# Altium project PCB_Project.PrjPcb
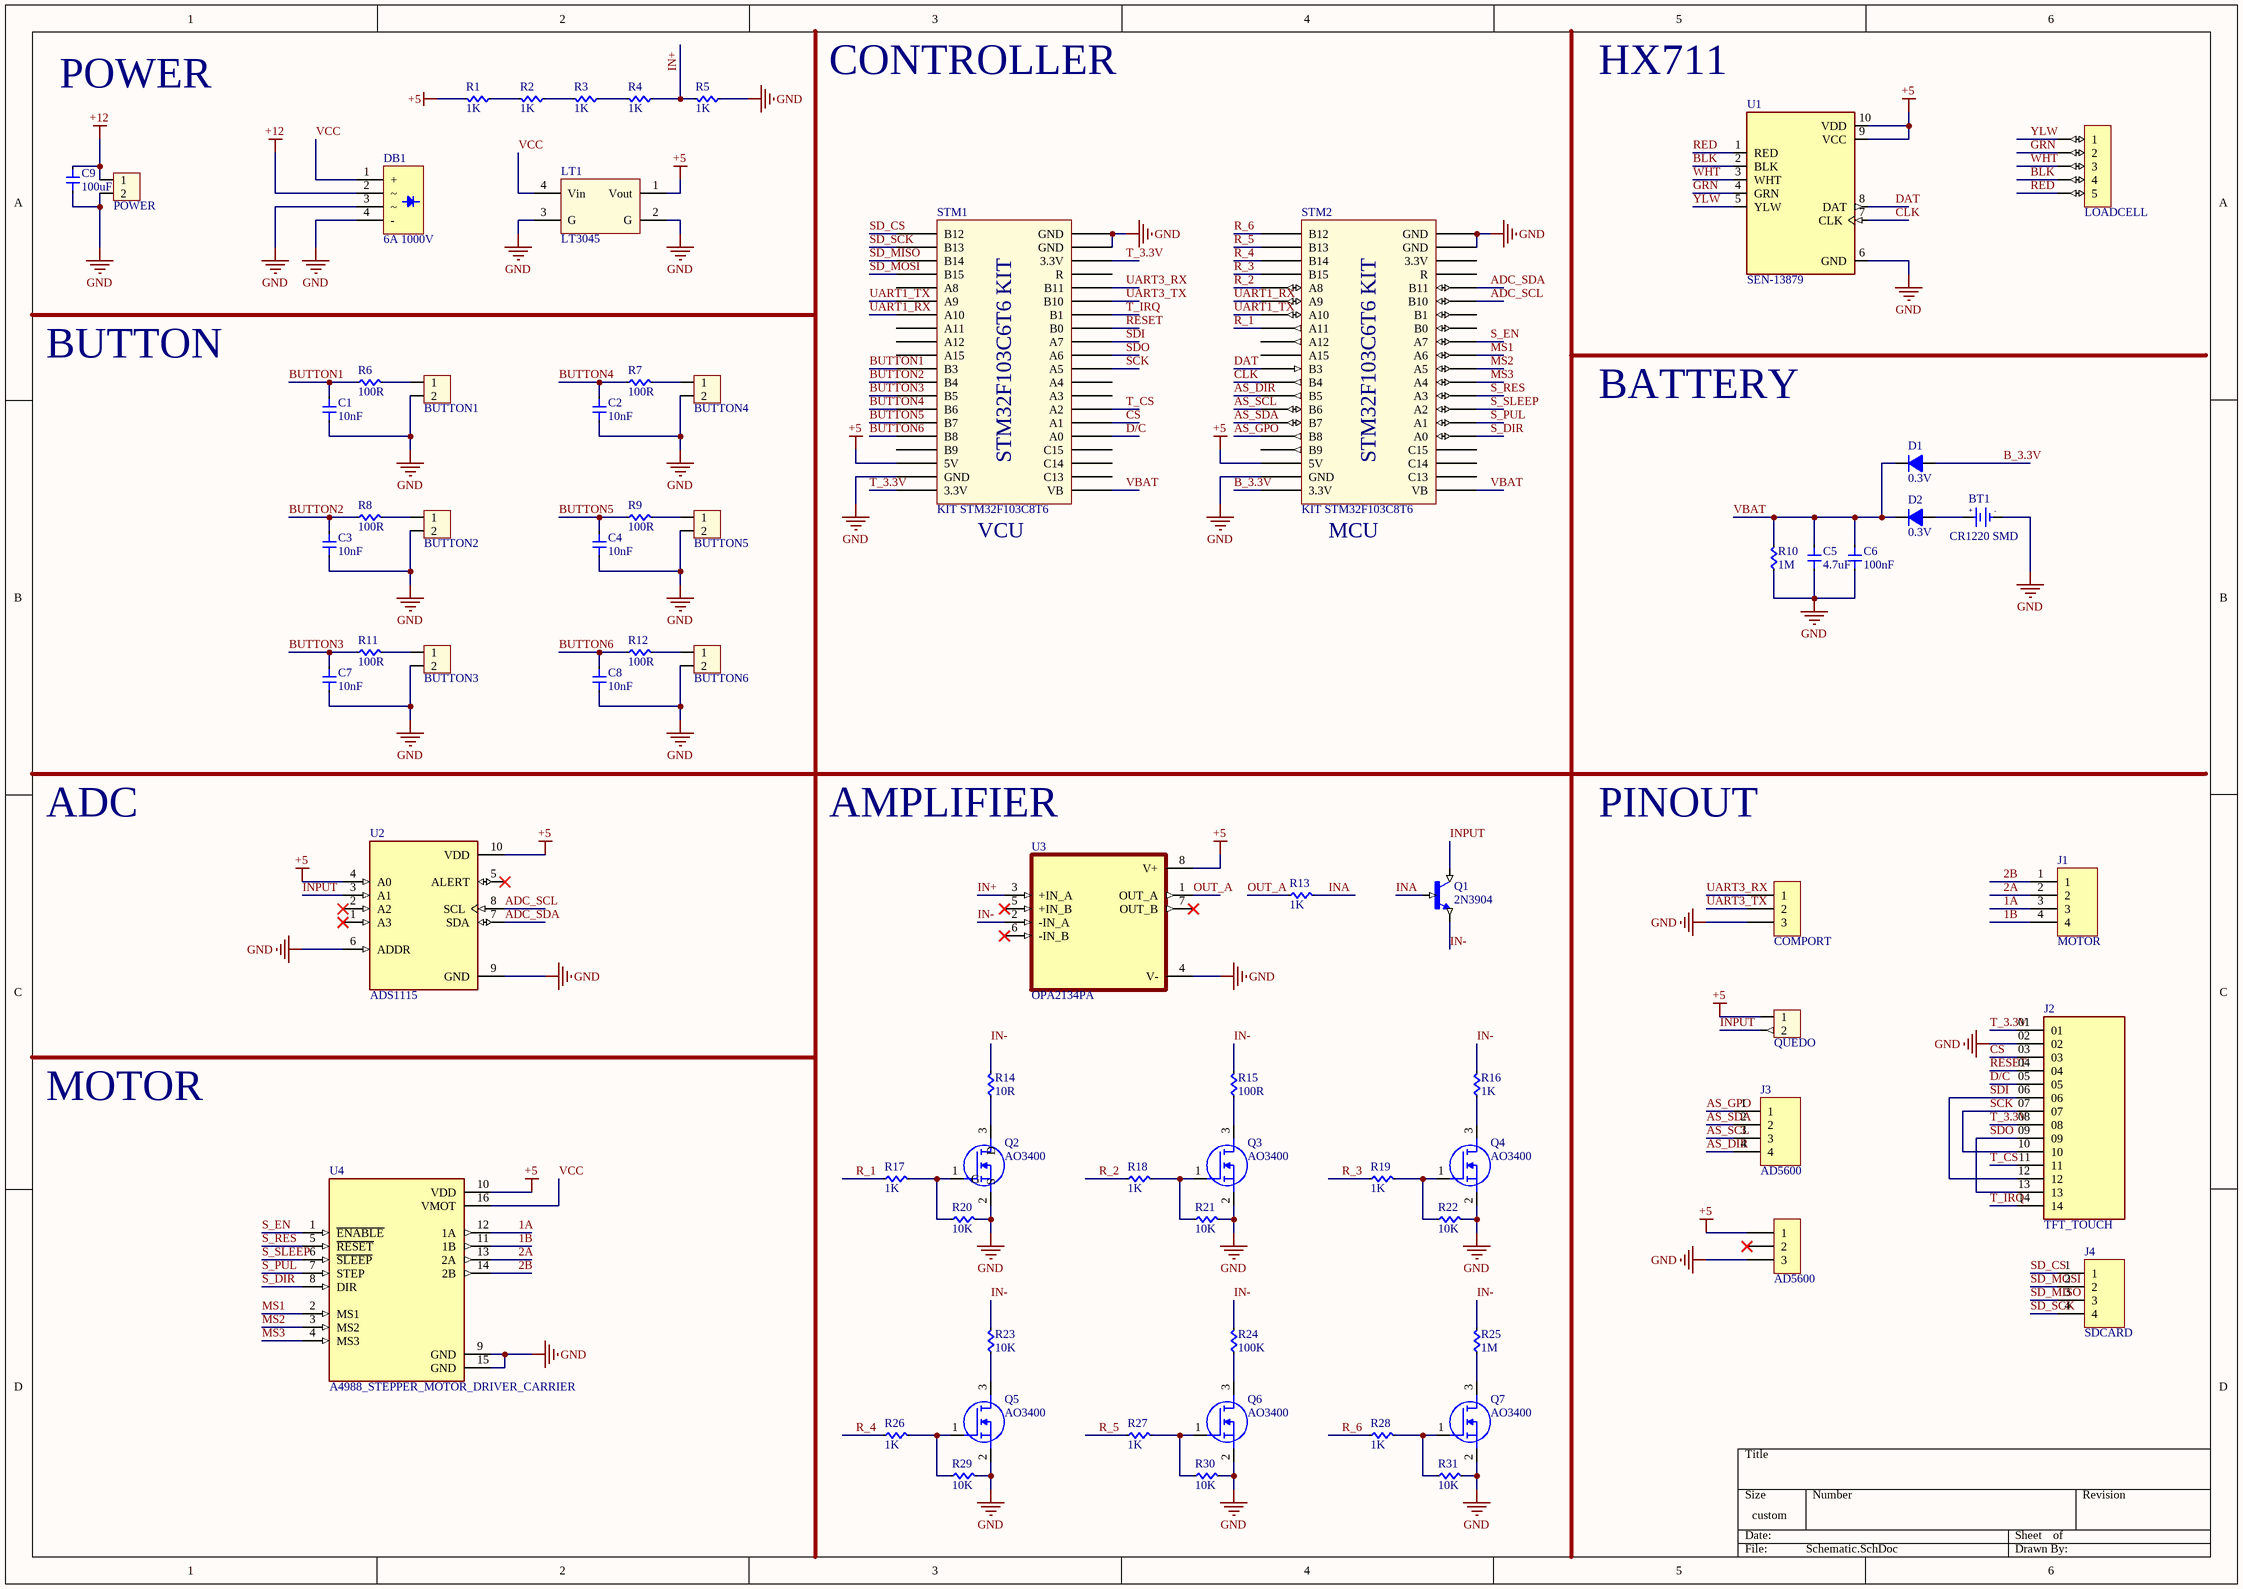
[diagram p0: Schematic.SchDoc]
1 sheet, 73 parts. Net scope: global (net labels, ports and power ports of the same name join across sheets).
Board file: PCB1.PcbDoc

## Sheet Schematic.SchDoc
size 420 x 297 mm; SheetNumber: 1; SheetTotal: 1

### Parts
BT1  CR1220 SMD  [DE PIN CR1220]
C1  10nF  [Cap 1206]
C2  10nF  [Cap 1206]
C3  10nF  [Cap 1206]
C4  10nF  [Cap 1206]
C5  4.7uF  [Cap 1206]
C6  100nF  [Cap 1206]
C7  10nF  [Cap 1206]
C8  10nF  [Cap 1206]
C9  100uF  [Cap 1206]
D1  0.3V  [DIODE 1A]
D2  0.3V  [DIODE 1A]
DB1  6A 1000V  [DIODE CAU 6A CAM]
H1  LOADCELL  [XH2.54M-5]
H2  POWER  [XH2.54M-2]
H3  BUTTON1  [XH2.54M-2]
H4  BUTTON4  [XH2.54M-2]
H5  BUTTON2  [XH2.54M-2]
H6  BUTTON5  [XH2.54M-2]
H7  BUTTON3  [XH2.54M-2]
H8  BUTTON6  [XH2.54M-2]
H9  COMPORT  [XH2.54M-3]
H10  QUEDO  [XH2.54M-2]
H11  AD5600  [XH2.54M-3]
J1  MOTOR  [CON4_78_B4B-PH-K-S(LF)(SN)]
J2  TFT_TOUCH  [SAMTEC_ESQ-114-38-G-S]
J3  AD5600  [CON4_78_B4B-PH-K-S(LF)(SN)]
J4  SDCARD  [CON4_78_B4B-PH-K-S(LF)(SN)]
LT1  LT3045  [PCBComponent_1]
Q1  2N3904  [TO92254P460H750-3]
Q2  AO3400  [SOT95P280X125-3N]
Q3  AO3400  [SOT95P280X125-3N]
Q4  AO3400  [SOT95P280X125-3N]
Q5  AO3400  [SOT95P280X125-3N]
Q6  AO3400  [SOT95P280X125-3N]
Q7  AO3400  [SOT95P280X125-3N]
R1  1K  [RES 1206]
R2  1K  [RES 1206]
R3  1K  [RES 1206]
R4  1K  [RES 1206]
R5  1K  [RES 1206]
R6  100R  [RES 1206]
R7  100R  [RES 1206]
R8  100R  [RES 1206]
R9  100R  [RES 1206]
R10  1M  [RES 1206]
R11  100R  [RES 1206]
R12  100R  [RES 1206]
R13  1K  [RES 1206]
R14  10R  [RES 1206]
R15  100R  [RES 1206]
R16  1K  [RES 1206]
R17  1K  [RES 1206]
R18  1K  [RES 1206]
R19  1K  [RES 1206]
R20  10K  [RES 1206]
R21  10K  [RES 1206]
R22  10K  [RES 1206]
R23  10K  [RES 1206]
R24  100K  [RES 1206]
R25  1M  [RES 1206]
R26  1K  [RES 1206]
R27  1K  [RES 1206]
R28  1K  [RES 1206]
R29  10K  [RES 1206]
R30  10K  [RES 1206]
R31  10K  [RES 1206]
STM1  KIT STM32F103C8T6  [STM32F103 KIT]
STM2  KIT STM32F103C8T6  [STM32F103 KIT]
U1  SEN-13879  [SPARKFUN_SEN-13879]
U2  ADS1115  [MODULE_ZC261500]
U3  OPA2134PA  [DIP794W45P254L959H508Q8]
U4  A4988_STEPPER_MOTOR_DRIVER_CARRIER  [MODULE_A4988_STEPPER_MOTOR_DRIVER_CARRIER]

### Nets
+5: H10.1 H11.1 LT1.1(Vout) R1.2 STM1.18(5V) STM2.18(5V) U1.9(VCC) U1.10(VDD) U2.4(A0) U2.10(VDD) U3.8(V+) U4.10(VDD)
+12: C9.1 DB1.2 H2.1
GND: BT1.2(GND) C1.2 C2.2 C3.2 C4.2 C5.2 C6.2 C7.2 C8.2 C9.2 DB1.3 DB1.4(-) H2.2 H3.2 H4.2 H5.2 H6.2 H7.2 H8.2 H9.3 H11.3 J2.02 LT1.2(G) LT1.3(G) Q2.2(S) Q3.2(S) Q4.2(S) Q5.2(S) Q6.2(S) Q7.2(S) R5.1 R10.1 R20.2 R21.2 R22.2 R29.2 R30.2 R31.2 STM1.19(GND) STM1.39(GND) STM1.40(GND) STM2.19(GND) STM2.39(GND) STM2.40(GND) U1.6(GND) U2.6(ADDR) U2.9(GND) U3.4(V-) U4.9(GND) U4.15(GND)
1A: J1.3 U4.12(1A)
1B: J1.4 U4.11(1B)
2A: J1.2 U4.13(2A)
2B: J1.1 U4.14(2B)
ADC_SCL: STM2.35(B10) U2.8(SCL)
ADC_SDA: STM2.36(B11) U2.7(SDA)
AS_DIR: J3.4 STM2.13(B5)
AS_GPO: J3.1 STM2.16(B8)
AS_SCL: J3.3 STM2.14(B6)
AS_SDA: J3.2 STM2.15(B7)
B_3.3V: D1.1(A) STM2.20(3.3V)
BLK: H1.4 U1.2(BLK)
BUTTON1: C1.1 R6.1 STM1.11(B3)
BUTTON2: C3.1 R8.1 STM1.12(B4)
BUTTON3: C7.1 R11.1 STM1.13(B5)
BUTTON4: C2.1 R7.1 STM1.14(B6)
BUTTON5: C4.1 R9.1 STM1.15(B7)
BUTTON6: C8.1 R12.1 STM1.16(B8)
CLK: STM2.12(B4) U1.7(CLK)
CS: J2.03 STM1.26(A1)
D/C: J2.05 STM1.25(A0)
DAT: STM2.11(B3) U1.8(DAT)
GRN: H1.2 U1.4(GRN)
IN+: R4.1 R5.2 U3.3(+IN_A)
IN-: Q1.1(E) R14.2 R15.2 R16.2 R23.2 R24.2 R25.2 U3.2(-IN_A)
INA: Q1.2(B) R13.2
INPUT: H10.2 Q1.3(C) U2.3(A1)
MS1: STM2.31(A6) U4.2(MS1)
MS2: STM2.30(A5) U4.3(MS2)
MS3: STM2.29(A4) U4.4(MS3)
OUT_A: R13.1 U3.1(OUT_A)
R_1: R17.1 STM2.8(A11)
R_2: R18.1 STM2.5(A8)
R_3: R19.1 STM2.4(B15)
R_4: R26.1 STM2.3(B14)
R_5: R27.1 STM2.2(B13)
R_6: R28.1 STM2.1(B12)
RED: H1.5 U1.1(RED)
RESET: J2.04 STM1.33(B0)
S_DIR: STM2.25(A0) U4.8(DIR)
S_EN: STM2.32(A7) U4.1(~{ENABLE})
S_PUL: STM2.26(A1) U4.7(STEP)
S_RES: STM2.28(A3) U4.5(~{RESET})
S_SLEEP: STM2.27(A2) U4.6(~{SLEEP})
SCK: J2.07 J2.10 STM1.30(A5)
SD_CS: J4.1 STM1.1(B12)
SD_MISO: J4.3 STM1.3(B14)
SD_MOSI: J4.2 STM1.4(B15)
SD_SCK: J4.4 STM1.2(B13)
SDI: J2.06 J2.12 STM1.32(A7)
SDO: J2.09 J2.13 STM1.31(A6)
T_3.3V: J2.01 J2.08 STM1.20(3.3V) STM1.38(3.3V)
T_CS: J2.11 STM1.27(A2)
T_IRQ: J2.14 STM1.34(B1)
UART1_RX: STM1.7(A10) STM2.6(A9)
UART1_TX: STM1.6(A9) STM2.7(A10)
UART3_RX: H9.1 STM1.36(B11)
UART3_TX: H9.2 STM1.35(B10)
VBAT: C5.1 C6.1 D1.2(K) D2.2(K) R10.2 STM1.21(VB) STM2.21(VB)
VCC: DB1.1(+) LT1.4(Vin) U4.16(VMOT)
WHT: H1.3 U1.3(WHT)
YLW: H1.1 U1.5(YLW)
NetBT1_1: BT1.1(+3V) D2.1(A)
NetH3_1: H3.1 R6.2
NetH4_1: H4.1 R7.2
NetH5_1: H5.1 R8.2
NetH6_1: H6.1 R9.2
NetH7_1: H7.1 R11.2
NetH8_1: H8.1 R12.2
NetQ2_1: Q2.1(G) R17.2 R20.1
NetQ2_3: Q2.3(D) R14.1
NetQ3_1: Q3.1(G) R18.2 R21.1
NetQ3_3: Q3.3(D) R15.1
NetQ4_1: Q4.1(G) R19.2 R22.1
NetQ4_3: Q4.3(D) R16.1
NetQ5_1: Q5.1(G) R26.2 R29.1
NetQ5_3: Q5.3(D) R23.1
NetQ6_1: Q6.1(G) R27.2 R30.1
NetQ6_3: Q6.3(D) R24.1
NetQ7_1: Q7.1(G) R28.2 R31.1
NetQ7_3: Q7.3(D) R25.1
NetR1_1: R1.1 R2.2
NetR2_1: R2.1 R3.2
NetR3_1: R3.1 R4.2

Not connected (* = marked no-connect by the designer): H11 2*; STM1 5(A8) 8(A11) 9(A12) 10(A15) 17(B9) 22(C13) 23(C14) 24(C15) 28(A3) 29(A4) 37(R); STM2 9(A12) 10(A15) 17(B9) 22(C13) 23(C14) 24(C15) 33(B0) 34(B1) 37(R) 38(3.3V); U2 1(A3)* 2(A2)* 5(ALERT)*; U3 5(+IN_B)* 6(-IN_B)* 7(OUT_B)*

### Notes on the sheet
- POWER
- CONTROLLER
- HX711
- BUTTON
- BATTERY
- (near STM1) VCU
- (near STM2) MCU
- ADC
- (near U3) AMPLIFIER
- PINOUT
- MOTOR
- (in symbol De pin CR1220 SMD) +; -
- (in symbol STM32f103 Bluepill) STM32F103C6T6 KIT

### Library data of the parts
BT1 = De pin CR1220 SMD: Ten: Đế PIN CR1220 SMD; Ma_Hang: MH000833
C1-C9 = Cap 1206: Capacitor SMD 1206
D1 D2 = Diode 1N4007: Cắm; Ten_Linh_Kien: Diode 1N4007 1A (DIP); Don_Vi: Con; Ma_Hang: MH001063; Ghi Chu: *; Kieu_Chan: *; Chung_Loai: Cắm
DB1 = Diode CAU 6A: Cắm; Ten_Linh_Kien: Diode Cầu 6A 1000V KBL610; Don_Vi: Con; Ma_Hang: MH004297; Ghi_Chu: *; Kieu_Chan: *; Chung_Loai: cắm
H1 = Header 5P 2.54 Duc Thang: Cắm; Ten_Linh_Kien: Header 5P XH2.54-5P Đực Thẳng; Don_Vi: Con; Ma_Hang: MH001298; Chung_Loai: Cắm
H2-H8 H10 = Header 2P 2.54 Duc Thang: Cắm; Ten_Linh_Kien: Header 2P XH2.54-2P Đực Thẳng; Don_Vi: Con; Ma_Hang: MH001283; Chung_Loai: Cắm
H9 H11 = Header 3P 2.54 Duc Thang: Cắm; Ten_Linh_Kien: Header 3P XH2.54-3P Đực Thẳng; Don_Vi: Con; Ma_Hang: MH001292; Chung_Loai: Cắm
J1 J3 J4 = CON-PLG_4X1-78-ST-TH: Connector Header Through Hole 4 position 0.079" (2.00mm); Manufacturer Part Number: B4B-PH-K-S(LF)(SN); Manufacturer: JST; Mating Part Number: PHR-4; Crimp Part Number: ASPHSPH24K51; Alternate Part Number-1: NA; Case/Package: TH; Supplier-1: SP Road; Supplier Part Number-1: NA
J2 = ESQ-114-38-G-S: Package: None; Availability: Unavailable; MP: ESQ-114-38-G-S; Value: *; Price: None
Q1 = 2N3904: BJT, TO-92, 40V, 200mA, NPN, 0.625W, 150Â°C; MF: Diotec Semiconductor; SnapEDA_Link: https://www.snapeda.com/parts/2N3904/Diotec/view-part/?ref=snap; Package: TO-92 Diotec; Value: *; MP: 2N3904; Check_prices: https://www.snapeda.com/parts/2N3904/Diotec/view-part/?ref=eda
Q2-Q7 = AO3400: N-Channel 30 V 5.8A (Ta) 1.4W (Ta) Surface Mount SOT-23-3; MF: Alpha &; SnapEDA_Link: https://www.snapeda.com/parts/AO3400/Alpha+%2526+Omega+Semiconductor+Inc./view-part/?ref=snap; Package: SOT-23-3 Alpha &amp; Omega Semiconductor; Value: *; MP: AO3400; Check_prices: https://www.snapeda.com/parts/AO3400/Alpha+%2526+Omega+Semiconductor+Inc./view-part/?ref=eda
R1-R19 R24-R28 = RES 1206: RES SMD 1206; Manufacturer: Vishay Dale; Manufacturer Part Number: CRCW040210K0FKED; Resistance (Ohms): 10k; Tolerance: ±1%; Power (Watts): 0.063W, 1/16W; Temperature Coefficient: ±100ppm/°C; Supplier 1: Digi-Key; RoHS: RoHS Compliant; Category: Resistors; Stock 1: 2392462; Pricing 1: 10=0.083, 50=0.0444, 200=0.0255, 1000=0.0174 (USD); Packaging: Cut Tape (CT); Composition: Thick Film; Features: Automotive AEC-Q200; Operating Temperature: -55°C ~ 155°C; Package / Case: 0402 (1005 Metric); Supplier Device Package: 0402 (1005 Metric); Size / Dimension: 0.039" L x 0.020" W (1.00mm x 0.50mm); Height: 0.016" (0.40mm); Number of Terminations: 2; ComponentLink1URL: http://www.vishay.com/docs/20035/dcrcwe3.pdf; ComponentLink1Description: http://www.vishay.com/docs/20035/dcrcwe3.pdf; Supplier Part Number 1: 541-10.0KLCT-ND
R20-R23 R29-R31 = RES 1206: RES SMD 1206; Manufacturer: Vishay Dale; Manufacturer Part Number: CRCW040210K0FKED; Tolerance: ±1%; Power (Watts): 0.063W, 1/16W; Temperature Coefficient: ±100ppm/°C; Supplier 1: Digi-Key; RoHS: RoHS Compliant; Category: Resistors; Stock 1: 2392462; Pricing 1: 10=0.083, 50=0.0444, 200=0.0255, 1000=0.0174 (USD); Packaging: Cut Tape (CT); Resistance (Ohms): 10k; Composition: Thick Film; Features: Automotive AEC-Q200; Operating Temperature: -55°C ~ 155°C; Package / Case: 0402 (1005 Metric); Supplier Device Package: 0402 (1005 Metric); Size / Dimension: 0.039" L x 0.020" W (1.00mm x 0.50mm); Height: 0.016" (0.40mm); Number of Terminations: 2; ComponentLink1URL: http://www.vishay.com/docs/20035/dcrcwe3.pdf; ComponentLink1Description: http://www.vishay.com/docs/20035/dcrcwe3.pdf; Supplier Part Number 1: 541-10.0KLCT-ND
STM1 STM2 = STM32f103 Bluepill: KIT STM32F103C8T6 Bluepill
U1 = SEN-13879: Load Cell Amp Hx711; Package: None; MP: SEN-13879; Price: None; Availability: Unavailable; Value: *
U2 = ZC261500: ADS1115 Module ADC 4 channel with Pro Gain Amplifier for Arduino RPi; MF: YKS; Value: *; SnapEDA_Link: https://www.snapeda.com/parts/ZC261500/YKS/view-part/621058/?ref=snap; MP: ZC261500; Availability: Unavailable; Price: None; Package: None
U3 = OPA2134PA: SoundPlus&trade; Audio Operational Amplifier with Low Distortion, Low Noise and Precision 8-PDIP -40 to 85; MF: Texas Instruments; Price: None; MP: OPA2134PA; SnapEDA_Link: https://www.snapeda.com/parts/OPA2134PA/Texas%20Instruments/view-part/621607/?ref=snap; Availability: Unavailable; Texas_Instruments-Purchase-URL: https://snapeda.com/shop?store=Texas+Instruments&id=621607; Value: *; Package: PDIP-8 Texas Instruments; BuyPart: https://www.snapeda.com/parts/OPA2134PA/Texas%20Instruments/view-part/621607/?ref=eda
U4 = A4988_STEPPER_MOTOR_DRIVER_CARRIER: Stepper motor controler; IC: A4988; 1A; Uin mot: 8Ã·35V; Price: None; Value: *; MP: A4988_STEPPER_MOTOR_DRIVER_CARRIER; Package: None; Availability: Unavailable